# Altium project Hello-Farogh-V1I0.PrjPcb (part 2 of 3)

## Sheet [05] - Ethernet & USB Hub.SchDoc: Ethernet & USB Hub
size A3; DrawnBy: Farogh; Organization: Farogh Iftekhar; Address1: Defence Coloney; Address2: New Delhi; Revision: V1I0; SheetNumber: 5
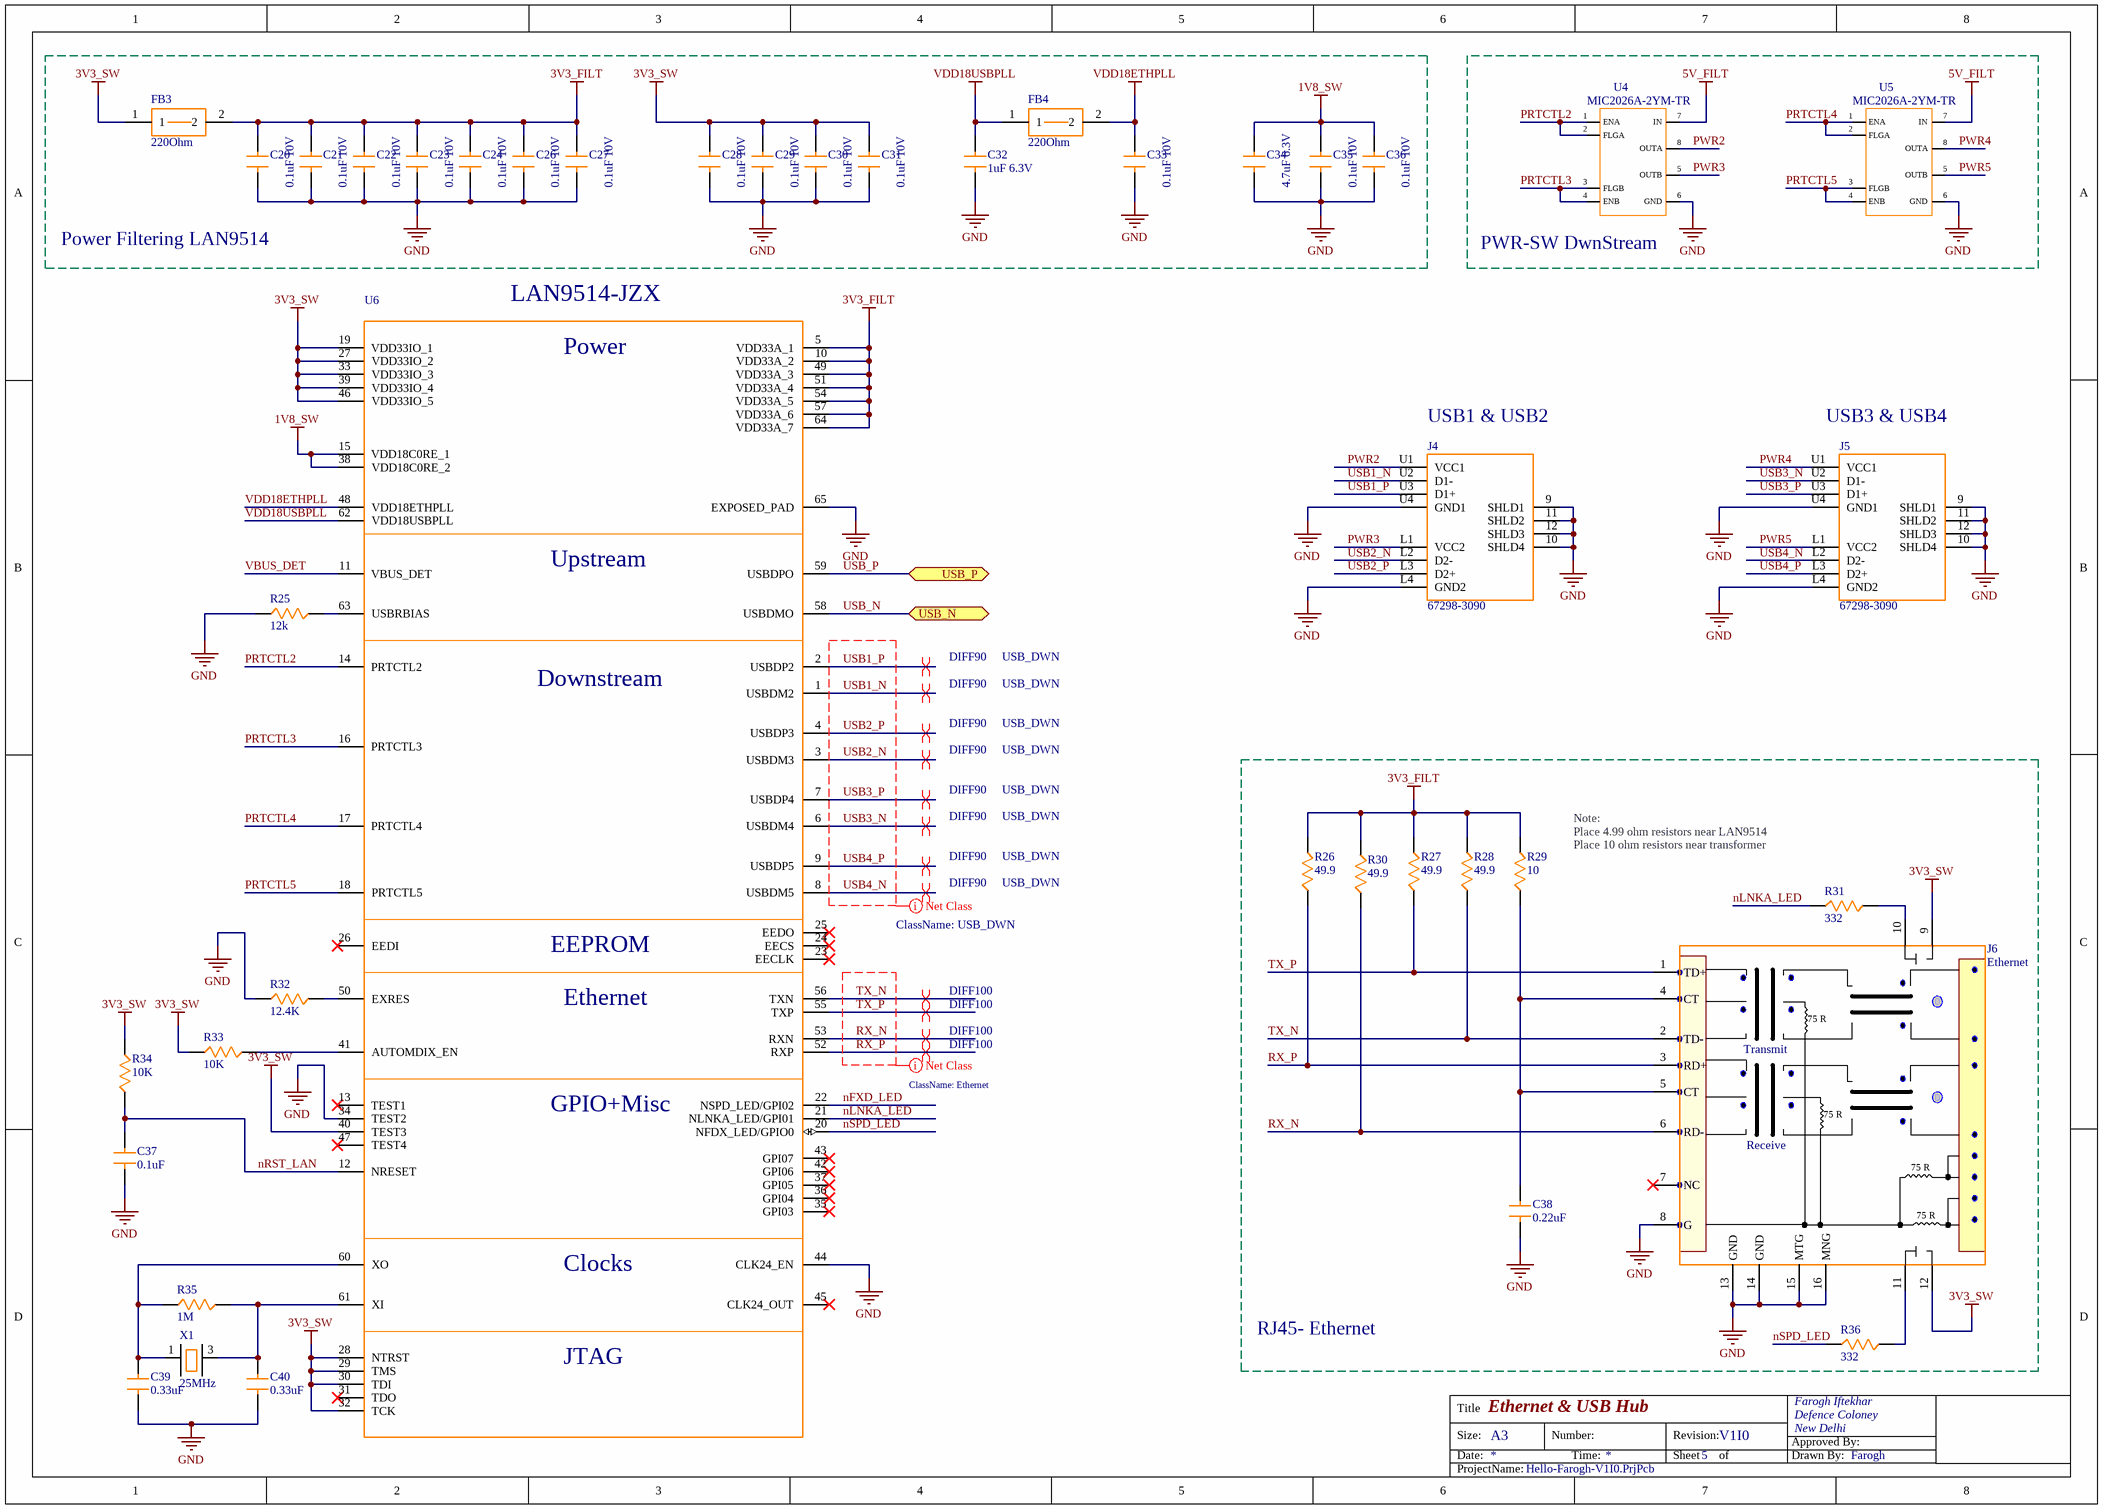
[diagram p4: [05] - Ethernet & USB Hub.SchDoc]

### Parts
C20  0.1uF 10V  [C0805]
C21  0.1uF 10V  [C0805]
C22  0.1uF 10V  [C0805]
C23  0.1uF 10V  [C0805]
C24  0.1uF 10V  [C0805]
C26  0.1uF 10V  [C0805]
C27  0.1uF 10V  [C0805]
C28  0.1uF 10V  [C0805]
C29  0.1uF 10V  [C0805]
C30  0.1uF 10V  [C0805]
C31  0.1uF 10V  [C0805]
C32  1uF 6.3V  [C0805]
C33  0.1uF 10V  [C0805]
C34  4.7uF 6.3V  [C0805]
C35  0.1uF 10V  [C0805]
C36  0.1uF 10V  [C0805]
C37  0.1uF  [C0805]
C38  0.22uF  [C0805]
C39  0.33uF  [C0805]
C40  0.33uF  [C0805]
FB3  220Ohm  [FB_0805]
FB4  220Ohm  [FB_0805]
J4  67298-3090  [67298-3090]
J5  67298-3090  [67298-3090]
J6  Ethernet  [Ethernet Port]
R25  12k  [R0805]
R26  49.9  [R0805]
R27  49.9  [R0805]
R28  49.9  [R0805]
R29  10  [R0805]
R30  49.9  [R0805]
R31  332  [R0805]
R32  12.4K  [R0805]
R33  10K  [R0805]
R34  10K  [R0805]
R35  1M  [R0805]
R36  332  [R0805]
U4  MIC2026A-2YM-TR  [MIC2026A-2YM-TR]
U5  MIC2026A-2YM-TR  [MIC2026A-2YM-TR]
U6  LAN9514-JZX  [LAN9514-JZX]
X1  25MHz  [ECS-250-18-30B-JTN-TR]

### Blocks framed on the sheet
Power Filtering LAN9514: C20-C24 C26-C36 FB3 FB4
PWR-SW DwnStream: U4 U5
RJ45- Ethernet: C38 J6 R26-R31 R36

### Ports
USB_N, USB_P

### Nets
1V8_SW: C34.2 C35.2 C36.2 U6.15(VDD18C0RE_1) U6.38(VDD18C0RE_2)
3V3_FILT: C20.2 C21.2 C22.2 C23.2 C24.2 C26.2 C27.2 FB3.2 R26.2 R27.2 R28.2 R29.2 R30.2 U6.5(VDD33A_1) U6.10(VDD33A_2) U6.49(VDD33A_3) U6.51(VDD33A_4) U6.54(VDD33A_5) U6.57(VDD33A_6) U6.64(VDD33A_7)
3V3_SW: C28.2 C29.2 C30.2 C31.2 FB3.1 J6.9 J6.12 R33.1 R34.2 U6.19(VDD33IO_1) U6.27(VDD33IO_2) U6.28(NTRST) U6.29(TMS) U6.30(TDI) U6.32(TCK) U6.33(VDD33IO_3) U6.39(VDD33IO_4) U6.40(TEST3) U6.46(VDD33IO_5)
5V_FILT: U4.7(IN) U5.7(IN)
GND: C20.1 C21.1 C22.1 C23.1 C24.1 C26.1 C27.1 C28.1 C29.1 C30.1 C31.1 C32.1 C33.1 C34.1 C35.1 C36.1 C37.1 C38.1 C39.1 C40.1 J4.9(SHLD1) J4.10(SHLD4) J4.11(SHLD2) J4.12(SHLD3) J4.L4(GND2) J4.U4(GND1) J5.9(SHLD1) J5.10(SHLD4) J5.11(SHLD2) J5.12(SHLD3) J5.L4(GND2) J5.U4(GND1) J6.8(G) J6.13(GND) J6.14(GND) J6.15(MTG) J6.16(MNG) R25.1 R32.1 U4.6(GND) U5.6(GND) U6.34(TEST2) U6.44(CLK24_EN) U6.65(EXPOSED_PAD)
VDD18ETHPLL: C33.2 FB4.2 U6.48(VDD18ETHPLL)
VDD18USBPLL: C32.2 FB4.1 U6.62(VDD18USBPLL)
nFXD_LED: U6.22(NSPD_LED/GPI02)
nLNKA_LED: R31.1 U6.21(NLNKA_LED/GPI01)
nRST_LAN: C37.2 R34.1 U6.12(NRESET)
nSPD_LED: R36.1 U6.20(NFDX_LED/GPIO0)
PRTCTL2: U4.1(ENA) U4.2(FLGA) U6.14(PRTCTL2)
PRTCTL3: U4.3(FLGB) U4.4(ENB) U6.16(PRTCTL3)
PRTCTL4: U5.1(ENA) U5.2(FLGA) U6.17(PRTCTL4)
PRTCTL5: U5.3(FLGB) U5.4(ENB) U6.18(PRTCTL5)
PWR2: J4.U1(VCC1) U4.8(OUTA)
PWR3: J4.L1(VCC2) U4.5(OUTB)
PWR4: J5.U1(VCC1) U5.8(OUTA)
PWR5: J5.L1(VCC2) U5.5(OUTB)
RX_N: J6.6(RD-) R30.1 U6.53(RXN)
RX_P: J6.3(RD+) R26.1 U6.52(RXP)
TX_N: J6.2(TD-) R28.1 U6.56(TXN)
TX_P: J6.1(TD+) R27.1 U6.55(TXP)
USB1_N: J4.U2(D1-) U6.1(USBDM2)
USB1_P: J4.U3(D1+) U6.2(USBDP2)
USB2_N: J4.L2(D2-) U6.3(USBDM3)
USB2_P: J4.L3(D2+) U6.4(USBDP3)
USB3_N: J5.U2(D1-) U6.6(USBDM4)
USB3_P: J5.U3(D1+) U6.7(USBDP4)
USB4_N: J5.L2(D2-) U6.8(USBDM5)
USB4_P: J5.L3(D2+) U6.9(USBDP5)
USB_N: U6.58(USBDMO) ; port USB_N
USB_P: U6.59(USBDPO) ; port USB_P
VBUS_DET: U6.11(VBUS_DET)
NetC38_2: C38.2 J6.4(CT) J6.5(CT) R29.1
NetC39_2: C39.2 R35.1 U6.60(XO) X1.1
NetC40_2: C40.2 R35.2 U6.61(XI) X1.3
NetJ6_10: J6.10 R31.2
NetJ6_11: J6.11 R36.2
NetR25_2: R25.2 U6.63(USBRBIAS)
NetR32_2: R32.2 U6.50(EXRES)
NetR33_2: R33.2 U6.41(AUTOMDIX_EN)

Not connected (* = marked no-connect by the designer): J6 7(NC)*; U6 13(TEST1)* 23(EECLK)* 24(EECS)* 25(EEDO)* 26(EEDI)* 31(TDO)* 35(GPI03)* 36(GPI04)* 37(GPI05)* 42(GPI06)* 43(GPI07)* 45(CLK24_OUT)* 47(TEST4)*

### Layout directives
differential pair; net class DIFF100: RX_N, RX_P, TX_N, TX_P
net class Ethernet: RX_N, RX_P, TX_N, TX_P
differential pair; net class DIFF90; net class USB_DWN: USB1_N, USB1_P, USB2_N, USB2_P, USB3_N, USB3_P, USB4_N, USB4_P
net class USB_DWN: USB1_N, USB1_P, USB2_N, USB2_P, USB3_N, USB3_P, USB4_N, USB4_P

### Notes on the sheet
- (near J4) USB1 & USB2
- (near J5) USB3 & USB4
- Note:
- Place 4.99 ohm resistors near LAN9514
- Place 10 ohm resistors near transformer
- Title
- Size:
- Date:
- A3
- Number:
- Time:
- Revision:
- Sheet
- of
- Approved By:
- Drawn By:
- ProjectName:
- (in symbol Ethernet Port-Pulse) 75 R; Transmit; Receive
- (in symbol LAN9514-JZX) Power; Upstream; Downstream; EEPROM; Ethernet; GPIO+Misc; Clocks; JTAG

### Library data of the parts
C20-C24 C26-C31 C33 C35-C37 = C_0805-0.1uF: Multilayer Ceramic Capacitors MLCC - SMD/SMT 0.1uF 10% 50V AEC-Q200; Manufacturer: Yageo; Manufacturer Part Number: AS0805KKX7R9BB104; Voltage Rating DC: 50 VDC; Capacitance - nF: 100 nF; Capacitance - pF: 100000 pF; CNHTS: 8532241000; Dielectric: X7R; TARIC: 8532240000; Product Status: New Product; Supplier 1: Mouser; RoHS: RoHS Compliant; Category: Multilayer Ceramic Capacitors MLCC - SMD/SMT; Stock 1: 30283; Pricing 1: 1=0.670, 10=0.461, 100=0.262, 500=0.238, 1000=0.165, 3000=0.156, 6000=0.146, 9000=0.136, 24000=0.122 (USD); Capacitance: 0.1 uF; Height: 1.25 mm; Length: 2 mm; Package / Case: 0805 (2012 metric); Packaging: Cut Tape; Product: Automotive MLCCs; Series: AS; Termination Style: SMD/SMT; Tolerance: 10 %; Width: 1.25 mm; Brand: Yageo; Case Code - in: 0805; Case Code - mm: 2212; HTS Code: 8532240020; Maximum Operating Temperature: + 125 C; Minimum Operating Temperature: - 55 C; Product Type: Ceramic Capacitors; Standard Pack Qty: 3000; Subcategory: Capacitors; Termination: Flexible (Soft); RoHS - Mouser: Y; Minimum Order Quantity: 1; Reeling: True; ComponentLink1URL: http://www.mouser.com/datasheet/2/447/yageodocoutput-1313910.pdf; ComponentLink1Description: http://www.mouser.com/datasheet/2/447/yageodocoutput-1313910.pdf; Supplier Part Number 1: 603-AS0805KKX79BB104
C32 = C_0805-1uF: Multilayer Ceramic Capacitors MLCC - SMD/SMT 10V 1uF X7R 0805 10%; Manufacturer: KEMET; Manufacturer Part Number: C0805C105K8RAC7210; Voltage Rating DC: 10 VDC; Capacitance - nF: 1000 nF; Class: Class 2; Product Status: New Product; Supplier 1: Mouser; RoHS: RoHS Compliant; Category: Multilayer Ceramic Capacitors MLCC - SMD/SMT; Stock 1: 38596; Pricing 1: 1=0.230, 10=0.104, 100=0.064, 500=0.057, 1000=0.048, 2000=0.041, 10000=0.036, 15000=0.032, 45000=0.028 (USD); Capacitance: 1 uF; Height: 0.9 mm; Length: 2 mm; Package / Case: 0805 (2012 metric); Packaging: Cut Tape; Product: General Type MLCCs; Series: SMD Comm X7R; Termination Style: SMD/SMT; Tolerance: 10 %; Width: 1.25 mm; Brand: KEMET; Case Code - in: 0805; Case Code - mm: 2012; Dielectric: X7R; Maximum Operating Temperature: + 125 C; Minimum Operating Temperature: - 55 C; Product Type: Ceramic Capacitors; Standard Pack Qty: 15000; Subcategory: Capacitors; Termination: Standard; RoHS - Mouser: Y; Minimum Order Quantity: 1; Reeling: True; ComponentLink1URL: https://www.mouser.com/datasheet/2/212/KEM_C1002_X7R_SMD-1102033.pdf; ComponentLink1Description: https://www.mouser.com/datasheet/2/212/KEM_C1002_X7R_SMD-1102033.pdf; Supplier Part Number 1: 80-C0805C105K8R7210
C34 = C_0805-4.7uF: Multilayer Ceramic Capacitors MLCC - SMD/SMT FACTORY NOT ACCEPTING ORDERS; Manufacturer: KEMET; Manufacturer Part Number: C0805X475K4RACAUTO; Tolerance: 10 %; Type: X7R Dielectric; Voltage Rating DC: 16 VDC; Capacitance - nF: 4700 nF; Class: Class 2; Dielectric: X7R; Qualification: AEC-Q200; Product Status: New Product; Supplier 1: Mouser; RoHS: RoHS Compliant; Category: Multilayer Ceramic Capacitors MLCC - SMD/SMT; Stock 1: 4312; Pricing 1: 1=0.860, 10=0.582, 100=0.363, 500=0.328, 1000=0.300, 2500=0.196, 10000=0.186, 25000=0.182, 50000=0.175 (USD); Capacitance: 4.7 uF; Height: 1.25 mm; Length: 2 mm; Package / Case: 0805 (2012 metric); Packaging: Reel; Product: Automotive MLCCs; Series: SMD Auto X7R Flex; Termination Style: SMD/SMT; Width: 1.25 mm; Brand: KEMET; Case Code - in: 0805; Case Code - mm: 2012; Maximum Operating Temperature: + 125 C; Minimum Operating Temperature: - 55 C; Product Type: Ceramic Capacitors; Standard Pack Qty: 2500; Subcategory: Capacitors; Termination: Flexible (Soft); Tradename: FT-CAP; RoHS - Mouser: Y; Minimum Order Quantity: 2500; Reeling: True; ComponentLink1URL: https://www.mouser.com/datasheet/2/212/KEM_C1078_X7R_FT-CAP_AUTO_SMD-1103315.pdf; ComponentLink1Description: https://www.mouser.com/datasheet/2/212/KEM_C1078_X7R_FT-CAP_AUTO_SMD-1103315.pdf; Supplier Part Number 1: 80-C0805X475K4RAUTO
C38 = C_0805-0.22uF: Multilayer Ceramic Capacitors MLCC - SMD/SMT 220nF 50V X7R 10%; Manufacturer: Yageo; Manufacturer Part Number: CC0805KKX7R9BB224; Type: General Purpose and High Capacitance Surface Mount Ceramic Multilayer Capacitor; Voltage Rating DC: 50 VDC; Capacitance - pF: 220000 pF; Class: Class 2; Supplier 1: Mouser; RoHS: RoHS Compliant By Exemption; Category: Multilayer Ceramic Capacitors MLCC - SMD/SMT; Stock 1: 41406; Pricing 1: 1=0.200, 10=0.103, 100=0.052, 1000=0.044, 3000=0.033, 9000=0.031, 24000=0.029, 45000=0.028, 99000=0.023 (USD); Capacitance: 0.22 uF; Height: 1.25 mm; Length: 2 mm; Package / Case: 0805 (2012 metric); Packaging: Cut Tape; Product: General Type MLCCs; Series: CC; Termination Style: SMD/SMT; Tolerance: 10 %; Width: 1.25 mm; Brand: Yageo; Capacitance - nF: 220 nF; Case Code - in: 0805; Case Code - mm: 2012; Dielectric: X7R; Maximum Operating Temperature: + 125 C; Minimum Operating Temperature: - 55 C; Product Type: Ceramic Capacitors; Standard Pack Qty: 3000; Subcategory: Capacitors; Termination: Standard; RoHS - Mouser: E; Minimum Order Quantity: 1; Reeling: True; ComponentLink1URL: https://www.mouser.com/datasheet/2/447/UPY-GPHC_X7R_6.3V-to-50V_18-1154002.pdf; ComponentLink1Description: https://www.mouser.com/datasheet/2/447/UPY-GPHC_X7R_6.3V-to-50V_18-1154002.pdf; Supplier Part Number 1: 603-CC805KKX7R9BB224
C39 C40 = C_0805-0.33uF: Multilayer Ceramic Capacitors MLCC - SMD/SMT 0805 0.33uF 50volts Y5V +80-20%; Manufacturer: Vishay / Vitramon; Manufacturer Part Number: VJ0805V334ZXAPW1BC; Tolerance: - 20 %, + 80 %; Voltage Rating DC: 50 VDC; Capacitance - nF: 330 nF; Capacitance - pF: 330000 pF; Class: Class 2; Supplier 1: Mouser; RoHS: RoHS Compliant; Category: Multilayer Ceramic Capacitors MLCC - SMD/SMT; Stock 1: 12325; Pricing 1: 1=0.190, 50=0.160, 100=0.119, 500=0.082, 15000=0.082 (USD); Capacitance: 0.33 uF; Height: 0.8 mm; Length: 2 mm; Package / Case: 0805 (2012 metric); Packaging: Cut Tape; Product: General Type MLCCs; Series: VJ W1BC Basic Comm; Termination Style: SMD/SMT; Voltage Rating AC: -; Width: 1.25 mm; Brand: Vishay / Vitramon; Case Code - in: 0805; Case Code - mm: 2012; Dielectric: Y5V; Maximum Operating Temperature: + 85 C; Minimum Operating Temperature: - 25 C; Product Type: Ceramic Capacitors; Standard Pack Qty: 15000; Subcategory: Capacitors; Termination: Flexible (Soft); RoHS - Mouser: Y; Minimum Order Quantity: 1; Reeling: True; ComponentLink1URL: https://www.mouser.com/datasheet/2/427/vjw1bcbascomseries-223529.pdf; ComponentLink1Description: https://www.mouser.com/datasheet/2/427/vjw1bcbascomseries-223529.pdf; Supplier Part Number 1: 77-VJ0805V334ZXAPBC
FB3 FB4 = FB_0805-220, 2000mA: Ferrite Beads WE-CBF 0805 SMD Bead 100MHz 220Ohm 2000mA; Manufacturer: Wurth Elektronik; Manufacturer Part Number: 742792022; Impedance: 220 Ohms; Maximum DC Current: 2 A; Maximum DC Resistance: 50 mOhms; Tolerance: 25 %; Type: SMD EMI Suppression Ferrite Bead WE-CBF; Supplier 1: Mouser; RoHS: RoHS Compliant; Category: Ferrite Beads; Stock 1: 10262; Pricing 1: 1=0.220, 10=0.215, 50=0.210, 100=0.193, 500=0.185, 1000=0.176, 2500=0.168, 4000=0.168 (USD); Capacitance: -; Height: 0.9 mm; Length: 2 mm; Operating Temperature Range: - 55 C to + 125 C; Package / Case: 0805 (2012 metric); Packaging: Cut Tape; Product: Ferrite Chip Beads; Series: WE-CBF; Termination Style: SMD/SMT; Width: 1.2 mm; Brand: Wurth Elektronik; Maximum Operating Temperature: + 125 C; Minimum Operating Temperature: - 55 C; Product Type: Ferrite Beads; Standard Pack Qty: 4000; Subcategory: Ferrites; Termination: -; Test Frequency: 100 MHz; RoHS - Mouser: Y; Minimum Order Quantity: 1; Reeling: True; ComponentLink1URL: https://www.mouser.com/datasheet/2/445/742792022-537936.pdf; ComponentLink1Description: https://www.mouser.com/datasheet/2/445/742792022-537936.pdf; Supplier Part Number 1: 710-742792022
J4 J5 = USBA-Dual-67298-3090: USB Connectors USB REC 8P RA SHLD TYPE A AUFL; Manufacturer: Molex; Connector Type: USB Type A; Current Rating: 1.5 A; Gender: Jack (Female); Mounting Angle: Right Angle; Number of Contacts: 8 Contact; Voltage Rating: 30 VDC; Number of Ports: 2 Port; Supplier 1: Mouser; Manufacturer Part Number: 67298-3090; RoHS: RoHS Compliant; Category: USB Connectors; Stock 1: 12294; Pricing 1: 1=1.37, 10=1.21, 100=1.10, 250=0.956, 500=0.928, 1000=0.792, 2500=0.764, 5000=0.726, 10000=0.710 (USD); Contact Plating: Gold; Packaging: Tray; Product: USB Type A Connectors; Series: 67298; Termination Style: Through Hole; Type: Type A; Brand: Molex; Contact Material: Tin; IP Rating: -; Maximum Operating Temperature: + 50 C; Minimum Operating Temperature: 0 C; Product Type: USB Connectors; Standard: USB; Standard Pack Qty: 200; Subcategory: USB Connectors; RoHS - Mouser: Y; Minimum Order Quantity: 1; Reeling: False; ComponentLink1URL: https://www.mouser.com/datasheet/2/276/0672983090_IO_CONNECTORS-172265.pdf; ComponentLink1Description: https://www.mouser.com/datasheet/2/276/0672983090_IO_CONNECTORS-172265.pdf
J6 = Ethernet Port-Pulse: Modular Connectors / Ethernet Connectors 1X1 TAB DOWN W/LEDS; Manufacturer: Pulse Electronics; Manufacturer Part Number: J0011D01BNL; Current Rating: 8 mA; Gender: Female; Number of Ports: 1 Port; Performance Category: Cat 5, Cat 6; USOC Codes: RJ45; Supplier 1: Mouser; RoHS: RoHS Compliant; Category: Modular Connectors / Ethernet Connectors; Stock 1: 1292; Pricing 1: 1=7.92, 10=7.59, 25=7.10, 50=6.60, 100=6.27, 250=5.61, 500=5.28 (USD); Contact Plating: Gold; Housing Material: Thermoplastic; Packaging: Tube; Series: J0; Termination Style: Through Hole; Brand: Pulse Electronics; Product Type: Modular Connectors / Ethernet Connectors; Standard Pack Qty: 30; Subcategory: Modular Connectors / Ethernet Connectors; RoHS - Mouser: Y; Minimum Order Quantity: 1; Reeling: False; ComponentLink1URL: https://www.mouser.com/datasheet/2/336/-370307.pdf; ComponentLink1Description: https://www.mouser.com/datasheet/2/336/-370307.pdf; Supplier Part Number 1: 673-J0011D01BNL
R25 = R_0805-12K: Thin Film Resistors - SMD 1/8W 12K ohm 1% 50ppm; Manufacturer: Yageo; Manufacturer Part Number: RT0805FRE0712KL; Power Rating: 125 mW (1/8 W); Resistance: 12 kOhms; Temperature Coefficient: 50 PPM / C; Voltage Rating: 150 V; CNHTS: 8533211000; MXHTS: 85332101; TARIC: 8533210000; Supplier 1: Mouser; RoHS: RoHS Compliant By Exemption; Category: Thin Film Resistors - SMD; Stock 1: 44126; Pricing 1: 1=0.120, 10=0.064, 100=0.023, 1000=0.016, 5000=0.011, 10000=0.010, 50000=0.009 (USD); Features: -; Height: 0.5 mm; Length: 2 mm; Operating Temperature Range: - 55 C to + 125 C; Package / Case: 0805 (2012 metric); Packaging: Cut Tape; Product: Thin Film Resistors SMD; Series: RT; Termination Style: SMD/SMT; Tolerance: 1 %; Type: High Precision, High Stability; Width: 1.25 mm; Brand: Yageo; Case Code - in: 0805; Case Code - mm: 2012; HTS Code: 8533210030; Maximum Operating Temperature: + 125 C; Minimum Operating Temperature: - 55 C; Product Type: Thin Film Resistors; Standard Pack Qty: 5000; Subcategory: Resistors; RoHS - Mouser: E; Minimum Order Quantity: 1; Reeling: True; ComponentLink1URL: http://www.mouser.com/datasheet/2/447/PYu-RT_1-to-0.01_RoHS_L_9-1222720.pdf; ComponentLink1Description: http://www.mouser.com/datasheet/2/447/PYu-RT_1-to-0.01_RoHS_L_9-1222720.pdf; Supplier Part Number 1: 603-RT0805FRE0712KL
R26-R28 R30 = R_0805-49.9: Thin Film Resistors - SMD 49.9 Ohms 0.1% Tol. AEC-Q200; Manufacturer: Yageo; Manufacturer Part Number: AT0805BRD0749R9L; Power Rating: 125 mW (1/8 W); Temperature Coefficient: 25 PPM / C; Voltage Rating: 150 V; Supplier 1: Mouser; RoHS: RoHS Compliant; Category: Thin Film Resistors - SMD; Stock 1: 3201; Pricing 1: 1=0.590, 10=0.416, 100=0.236, 1000=0.191, 5000=0.164, 10000=0.159, 25000=0.155, 50000=0.154 (USD); Diameter: -; Features: -; Height: 0.5 mm; Length: 2 mm; Operating Temperature Range: - 55 C to + 125 C; Package / Case: 0805 (2012 metric); Packaging: Cut Tape; Product: Thin Film Resistors SMD; Resistance: 49.9 Ohms; Series: AT; Termination Style: SMD/SMT; Tolerance: 0.1 %; Type: High Precision High Stability Chip Resistors; Width: 1.25 mm; Brand: Yageo; Case Code - in: 0805; Case Code - mm: 2012; Maximum Operating Temperature: + 125 C; Minimum Operating Temperature: - 55 C; Qualification: AEC-Q200; Standard Pack Qty: 5000; RoHS - Mouser: Y; Minimum Order Quantity: 1; Reeling: True; ComponentLink1URL: https://www.mouser.com/datasheet/2/447/PYu-AT_51_RoHS_L_5-1222714.pdf; ComponentLink1Description: https://www.mouser.com/datasheet/2/447/PYu-AT_51_RoHS_L_5-1222714.pdf; Supplier Part Number 1: 603-AT0805BRD0749R9L
R29 = R_0805-10: Thick Film Resistors - SMD 10    OHM   1% 1/4W; Manufacturer: Yageo; Manufacturer Part Number: RC0805FR-7W10RL; Power Rating: 125 mW, 250 mW; Resistance: 10 Ohms; Temperature Coefficient: 200 PPM / C; Voltage Rating: 150 V; CNHTS: 8533211000; MXHTS: 85332101; TARIC: 8533210000; Supplier 1: Mouser; RoHS: RoHS Compliant; Category: Thick Film Resistors - SMD; Stock 1: 18733; Pricing 1: 1=0.150, 10=0.078, 100=0.027, 1000=0.020, 5000=0.014, 10000=0.013, 25000=0.012, 50000=0.011 (USD); Application: High Reliability; Features: -; Height: 0.5 mm; Length: 2 mm; Package / Case: 0805 (2012 metric); Packaging: Cut Tape; Product: Thick Film Resistors SMD; Series: RC; Technology: Thick Film; Termination Style: SMD/SMT; Tolerance: 1 %; Type: High Power; Width: 1.25 mm; Brand: Yageo; Mounting Style: PCB Mount; Case Code - in: 0805; Case Code - mm: 2012; HTS Code: 8533210030; Maximum Operating Temperature: + 155 C; Minimum Operating Temperature: - 55 C; Product Type: Thick Film Resistors; Standard Pack Qty: 5000; Subcategory: Resistors; RoHS - Mouser: Y; Minimum Order Quantity: 1; Reeling: True; ComponentLink1URL: http://www.mouser.com/datasheet/2/447/yageo_01152019_DESIGN_KITS_8_2012-1522572.pdf; ComponentLink1Description: http://www.mouser.com/datasheet/2/447/yageo_01152019_DESIGN_KITS_8_2012-1522572.pdf; Supplier Part Number 1: 603-RC0805FR-7W10RL
R31 R36 = R_0805-332: Thin Film Resistors - SMD 5; Manufacturer: KOA Speer; Manufacturer Part Number: RN732ATTDK3320B25; Power Rating: 100 mW (1/10 W); Resistance: 332 Ohms; Temperature Coefficient: 25 PPM / C; Tolerance: 0.1 %; Voltage Rating: 150 V; Product Status: New at Mouser; Supplier 1: Mouser; Category: Thin Film Resistors - SMD; Stock 1: 965; Pricing 1: 1=0.510, 25=0.482, 50=0.471, 100=0.457, 250=0.358, 500=0.318, 1000=0.309, 2000=0.268 (USD); Features: -; Height: 0.5 mm; Length: 2 mm; Operating Temperature Range: - 55 C to + 155 C; Package / Case: 0805 (2012 metric); Product: Precision Resistors Thin Film SMD; Series: RN73; Termination Style: SMD/SMT; Type: Thin Film (Metal) Chip Resistor-Ultra High Precision Tolerance; Width: 1.25 mm; Brand: KOA Speer; Case Code - in: 0805; Case Code - mm: 2012; Maximum Operating Temperature: + 155 C; Minimum Operating Temperature: - 55 C; Minimum Order Quantity: 1; Reeling: False; ComponentLink1URL: https://www.mouser.com/datasheet/2/219/RN73-11994.pdf; ComponentLink1Description: https://www.mouser.com/datasheet/2/219/RN73-11994.pdf; Supplier Part Number 1: 660-RN732ATTDK3320B2
R32 = R_0805-12.4K: Thin Film Resistors - SMD; Manufacturer: Yageo; Manufacturer Part Number: RT0805DRE0712K4L; Power Rating: 125 mW (1/8 W); Resistance: 12.4 kOhms; Temperature Coefficient: 50 PPM / C; Tolerance: 0.5 %; Voltage Rating: 150 V; Supplier 1: Mouser; RoHS: RoHS Compliant; Category: Thin Film Resistors - SMD; Stock 1: 13805; Pricing 1: 1=0.170, 10=0.088, 100=0.031, 1000=0.022, 5000=0.015, 10000=0.014, 25000=0.013, 50000=0.012 (USD); Features: -; Height: 0.5 mm; Length: 2 mm; Operating Temperature Range: - 55 C to + 125 C; Package / Case: 0805 (2012 metric); Packaging: Cut Tape; Product: Thin Film Resistors SMD; Series: RT; Termination Style: SMD/SMT; Type: High Precision, High Stability; Width: 1.2 mm; Brand: Yageo; Case Code - in: 0805; Case Code - mm: 2012; Maximum Operating Temperature: + 125 C; Minimum Operating Temperature: - 55 C; Standard Pack Qty: 5000; RoHS - Mouser: Y; Minimum Order Quantity: 1; Reeling: True; ComponentLink1URL: https://www.mouser.com/datasheet/2/447/PYu-RT_1-to-0.01_RoHS_L_9-1222720.pdf; ComponentLink1Description: https://www.mouser.com/datasheet/2/447/PYu-RT_1-to-0.01_RoHS_L_9-1222720.pdf; Supplier Part Number 1: 603-RT0805DRE0712K4L
R33 R34 = R_0805-10K: Thick Film Resistors - SMD 10K   OHM   1% 1/4W; Manufacturer: Yageo; Manufacturer Part Number: RC0805FR-7W10KL; Power Rating: 125 mW, 250 mW; Resistance: 10 kOhms; Temperature Coefficient: 100 PPM / C; Voltage Rating: 150 V; CNHTS: 8533211000; MXHTS: 85332101; TARIC: 8533210000; Supplier 1: Mouser; RoHS: RoHS Compliant; Category: Thick Film Resistors - SMD; Stock 1: 8240; Pricing 1: 1=0.190, 10=0.115, 100=0.038, 1000=0.026, 5000=0.020, 10000=0.019, 25000=0.018, 100000=0.017 (USD); Application: High Reliability; Features: -; Height: 0.5 mm; Length: 2 mm; Package / Case: 0805 (2012 metric); Packaging: Cut Tape; Product: Thick Film Resistors SMD; Series: RC; Technology: Thick Film; Termination Style: SMD/SMT; Tolerance: 1 %; Type: High Power; Width: 1.25 mm; Brand: Yageo; Mounting Style: PCB Mount; Case Code - in: 0805; Case Code - mm: 2012; HTS Code: 8533210030; Maximum Operating Temperature: + 155 C; Minimum Operating Temperature: - 55 C; Product Type: Thick Film Resistors; Standard Pack Qty: 5000; Subcategory: Resistors; RoHS - Mouser: Y; Minimum Order Quantity: 1; Reeling: True; ComponentLink1URL: http://www.mouser.com/datasheet/2/447/yageo_01152019_DESIGN_KITS_8_2012-1522572.pdf; ComponentLink1Description: http://www.mouser.com/datasheet/2/447/yageo_01152019_DESIGN_KITS_8_2012-1522572.pdf; Supplier Part Number 1: 603-RC0805FR-7W10KL
R35 = R_0805-1M: Thin Film Resistors - SMD 1 Mohm 0.5% Tol. AEC-Q200; Manufacturer: Yageo; Manufacturer Part Number: AT0805DRD071ML; Power Rating: 125 mW (1/8 W); Resistance: 1 MOhms; Temperature Coefficient: 25 PPM / C; Voltage Rating: 150 V; CNHTS: 8533211000; MXHTS: 85332101; TARIC: 8533210000; Supplier 1: Mouser; RoHS: RoHS Compliant; Category: Thin Film Resistors - SMD; Stock 1: 10768; Pricing 1: 1=0.550, 10=0.322, 100=0.129, 1000=0.099, 5000=0.076, 10000=0.074, 25000=0.071, 50000=0.070, 100000=0.069 (USD); Diameter: -; Features: -; Height: 0.5 mm; Length: 2 mm; Operating Temperature Range: - 55 C to + 125 C; Package / Case: 0805 (2012 metric); Packaging: Cut Tape; Product: Thin Film Resistors SMD; Series: AT; Technology: Thin Film; Termination Style: SMD/SMT; Tolerance: 0.5 %; Type: High Precision High Stability Chip Resistors; Width: 1.25 mm; Brand: Yageo; Mounting Style: PCB Mount; Case Code - in: 0805; Case Code - mm: 2012; HTS Code: 8533210030; Maximum Operating Temperature: + 125 C; Minimum Operating Temperature: - 55 C; Product Type: Thin Film Resistors; Qualification: AEC-Q200; Standard Pack Qty: 5000; Subcategory: Resistors; RoHS - Mouser: Y; Minimum Order Quantity: 1; Reeling: True; ComponentLink1URL: http://www.mouser.com/datasheet/2/447/PYu-AT_51_RoHS_L_5-1222714.pdf; ComponentLink1Description: http://www.mouser.com/datasheet/2/447/PYu-AT_51_RoHS_L_5-1222714.pdf; Supplier Part Number 1: 603-AT0805DRD071ML
U4 U5 = MIC2026A-2YM-TR: Power Switch ICs - Power Distribution Dual USB High-Side Power Switch; Manufacturer: Microchip Technology / Micrel; Number of Outputs: 2 Output; Output Current: 500 mA; Current Limit: 2 A; Off Time - Max: 100 us; On Resistance - Max: 140 mOhms; On Time - Max: 5 ms; CNHTS: 8542319000; MXHTS: 85423901; Operating Supply Voltage: 2.7 V to 5.5 V; Supply Voltage - Max: 5.5 V; Supply Voltage - Min: 2.7 V; TARIC: 8542399000; Supplier 1: Mouser; Manufacturer Part Number: MIC2026A-2YM-TR; RoHS: RoHS Compliant; Category: Power Switch ICs - Power Distribution; Stock 1: 7427; Pricing 1: 1=0.790, 10=0.781, 25=0.659, 100=0.597, 2500=0.597 (USD); Package / Case: SOIC-8; Packaging: Cut Tape; Product: Power Switches; Type: High Side; Brand: Microchip Technology / Micrel; Mounting Style: SMD/SMT; HTS Code: 8542390001; Maximum Operating Temperature: + 85 C; Minimum Operating Temperature: - 40 C; Product Type: Power Switch ICs - Power Distribution; Standard Pack Qty: 2500; Subcategory: Switch ICs; RoHS - Mouser: Y; Minimum Order Quantity: 1; Reeling: True; ComponentLink1URL: http://www.mouser.com/datasheet/2/268/mic2026a-76a-1076848.pdf; ComponentLink1Description: http://www.mouser.com/datasheet/2/268/mic2026a-76a-1076848.pdf; Supplier Part Number 1: 998-MIC2026A-2YMTR
U6 = LAN9514-JZX: USB Interface IC USB 4 Port Hub Int 10/100 Ethernet; Manufacturer: Microchip Technology; Data Rate: 480 Mb/s, 1.5 Mb/s; Speed: High Speed; CNHTS: 8542319000; MXHTS: 85423199; Supplier 1: Mouser; Manufacturer Part Number: LAN9514-JZX; RoHS: RoHS Compliant; Category: USB Interface IC; Stock 1: 2733; Pricing 1: 1=5.70, 10=5.62, 25=4.75, 100=4.32 (USD); Package / Case: QFN-64; Packaging: Tray; Product: USB Hub Controllers; Series: LAN9514; Type: Hub Controller; Brand: Microchip Technology; Mounting Style: SMD/SMT; HTS Code: 8542310001; Maximum Operating Temperature: + 70 C; Minimum Operating Temperature: 0 C; Product Type: USB Interface IC; Standard: USB 2.0; Standard Pack Qty: 260; Subcategory: Interface ICs; TARIC: 8542319000; RoHS - Mouser: Y; Minimum Order Quantity: 1; Reeling: False; ComponentLink1URL: http://www.mouser.com/datasheet/2/268/9514-477449.pdf; ComponentLink1Description: http://www.mouser.com/datasheet/2/268/9514-477449.pdf; Supplier Part Number 1: 886-LAN9514-JZX
X1 = ECS-25MHz: Crystals 25MHz 20ppm 18pF -40C +85C; Manufacturer: ECS; Drive Level: 300 uW; Supplier 1: Mouser; Manufacturer Part Number: ECS-250-18-30B-JTN-TR; RoHS: RoHS Compliant; Category: Crystals; Stock 1: 1092; Pricing 1: 1=0.700, 10=0.575, 50=0.518, 100=0.460, 500=0.438, 1000=0.368, 2000=0.345, 5000=0.334, 10000=0.322 (USD); Frequency: 25 MHz; Frequency Stability: 20 PPM; Height: 0.85 mm; Length: 5 mm; Load Capacitance: 18 pF; Package / Case: 5 mm x 3.2 mm; Packaging: Cut Tape; Product: Crystals; Series: ECX-53B; Termination Style: SMD/SMT; Tolerance: 20 PPM; Width: 3.2 mm; Brand: ECS; Mounting Style: SMD/SMT; Maximum Operating Temperature: + 85 C; Minimum Operating Temperature: - 40 C; Product Type: Crystals; Standard Pack Qty: 1000; Subcategory: Crystals; RoHS - Mouser: Y; Minimum Order Quantity: 1; Reeling: True; ComponentLink1URL: https://www.mouser.com/datasheet/2/122/ecx_53b-1479911.pdf; ComponentLink1Description: https://www.mouser.com/datasheet/2/122/ecx_53b-1479911.pdf; Supplier Part Number 1: 520-250-18-30B-JTNT